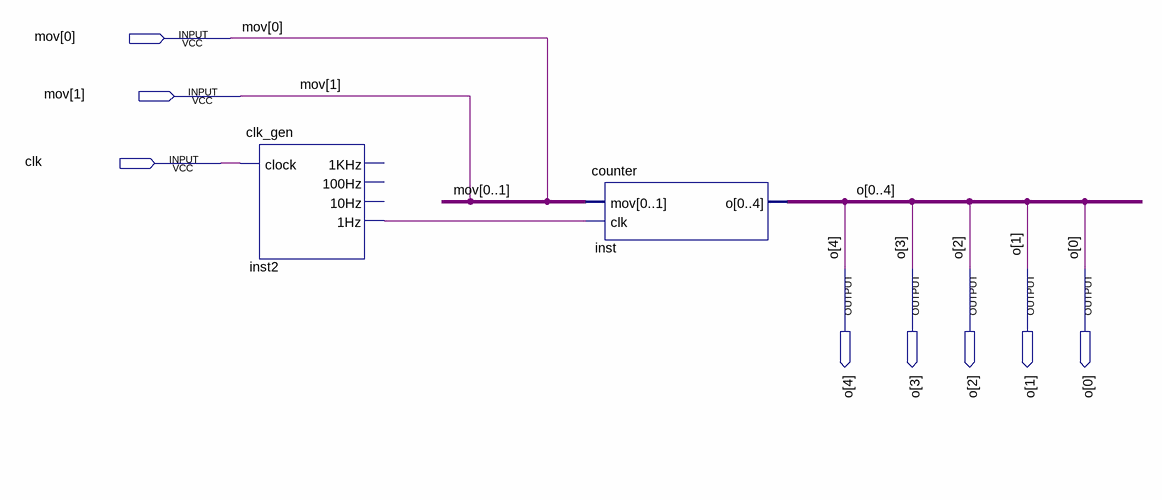
[diagram p0: schematic sheet]
// Quartus schematic flrCtr.bdf as structural Verilog: 2 symbols, 8 pins
module flrCtr (
  input  [1:0] mov,
  input  clk,
  output [4:0] o
);

  wire inst2_1hz;

  clk_gen inst2 (.clock(clk), .\1Hz (inst2_1hz));  // open: 1KHz, 100Hz, 10Hz
  counter inst (.mov({mov[0], mov[1]}), .clk(inst2_1hz), .o({o[0], o[1], o[2], o[3], o[4]}));
endmodule
